# EAGLE design fancontroller (EAGLE 9.0.0)
Assembly variants: No OSC

## Sheet 1 of 2
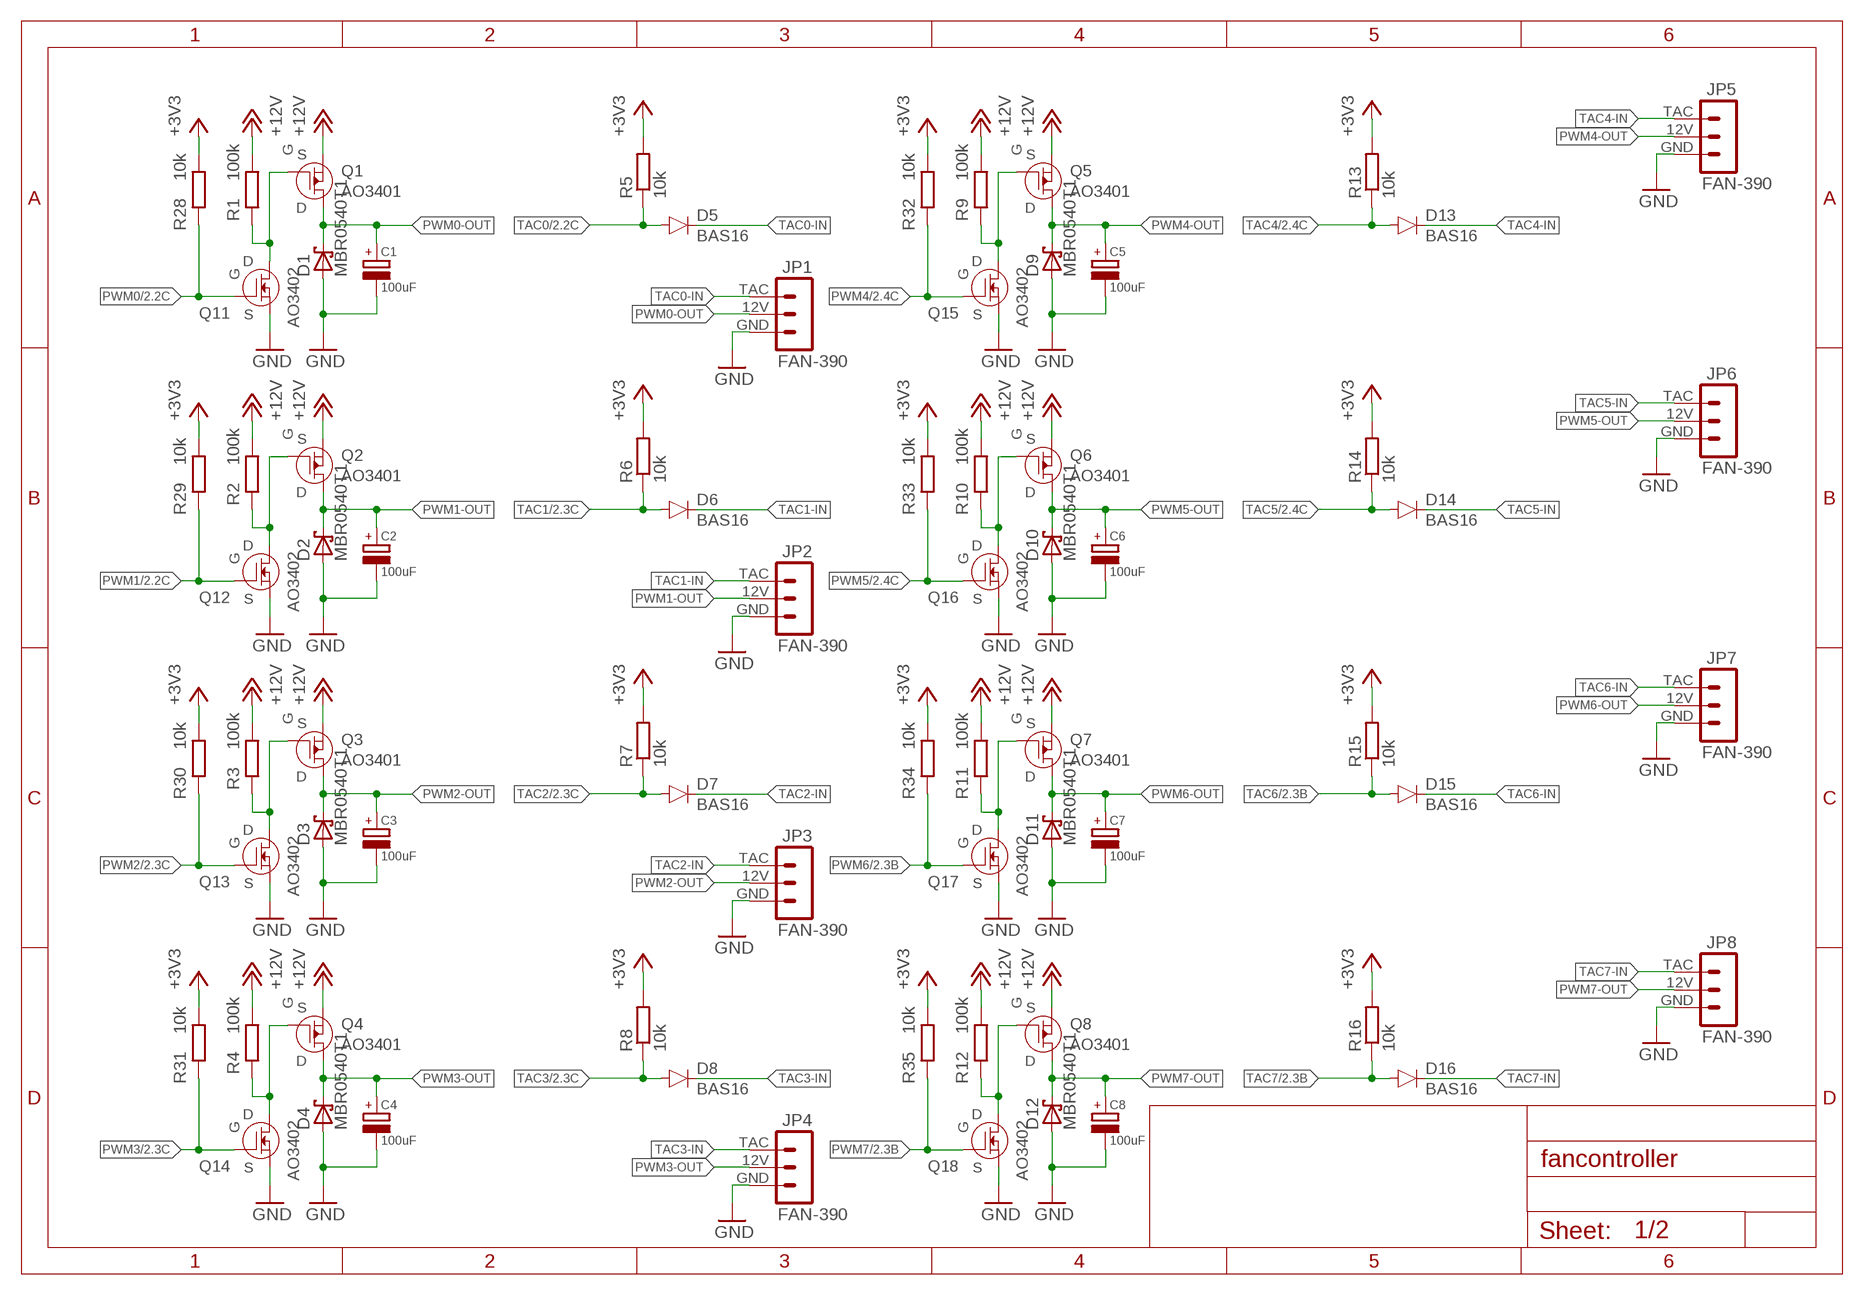
[diagram p0: schematic, sheet 1]

### Parts
C1  100uF  CAPACITOR  [CAP-D6.3]
C2  100uF  CAPACITOR  [CAP-D6.3]
C3  100uF  CAPACITOR  [CAP-D6.3]
C4  100uF  CAPACITOR  [CAP-D6.3]
C5  100uF  CAPACITOR  [CAP-D6.3]
C6  100uF  CAPACITOR  [CAP-D6.3]
C7  100uF  CAPACITOR  [CAP-D6.3]
C8  100uF  CAPACITOR  [CAP-D6.3]
D1  MBR0540T1  [SOD123]
D2  MBR0540T1  [SOD123]
D3  MBR0540T1  [SOD123]
D4  MBR0540T1  [SOD123]
D5  BAS16  [SOT23-3]
D6  BAS16  [SOT23-3]
D7  BAS16  [SOT23-3]
D8  BAS16  [SOT23-3]
D9  MBR0540T1  [SOD123]
D10  MBR0540T1  [SOD123]
D11  MBR0540T1  [SOD123]
D12  MBR0540T1  [SOD123]
D13  BAS16  [SOT23-3]
D14  BAS16  [SOT23-3]
D15  BAS16  [SOT23-3]
D16  BAS16  [SOT23-3]
JP1  FAN-390  [FAN-3PIN/90]
JP2  FAN-390  [FAN-3PIN/90]
JP3  FAN-390  [FAN-3PIN/90]
JP4  FAN-390  [FAN-3PIN/90]
JP5  FAN-390  [FAN-3PIN/90]
JP6  FAN-390  [FAN-3PIN/90]
JP7  FAN-390  [FAN-3PIN/90]
JP8  FAN-390  [FAN-3PIN/90]
Q1  AO3401  [SOT23-3]
Q2  AO3401  [SOT23-3]
Q3  AO3401  [SOT23-3]
Q4  AO3401  [SOT23-3]
Q5  AO3401  [SOT23-3]
Q6  AO3401  [SOT23-3]
Q7  AO3401  [SOT23-3]
Q8  AO3401  [SOT23-3]
Q11  AO3402  [SOT23-3]
Q12  AO3402  [SOT23-3]
Q13  AO3402  [SOT23-3]
Q14  AO3402  [SOT23-3]
Q15  AO3402  [SOT23-3]
Q16  AO3402  [SOT23-3]
Q17  AO3402  [SOT23-3]
Q18  AO3402  [SOT23-3]
R1  100k  RR0603  [R0603]
R2  100k  RR0603  [R0603]
R3  100k  RR0603  [R0603]
R4  100k  RR0603  [R0603]
R5  10k  RR0603  [R0603]
R6  10k  RR0603  [R0603]
R7  10k  RR0603  [R0603]
R8  10k  RR0603  [R0603]
R9  100k  RR0603  [R0603]
R10  100k  RR0603  [R0603]
R11  100k  RR0603  [R0603]
R12  100k  RR0603  [R0603]
R13  10k  RR0603  [R0603]
R14  10k  RR0603  [R0603]
R15  10k  RR0603  [R0603]
R16  10k  RR0603  [R0603]
R28  10k  RR0603  [R0603]
R29  10k  RR0603  [R0603]
R30  10k  RR0603  [R0603]
R31  10k  RR0603  [R0603]
R32  10k  RR0603  [R0603]
R33  10k  RR0603  [R0603]
R34  10k  RR0603  [R0603]
R35  10k  RR0603  [R0603]

### Nets
+3V3: R5.2 R6.2 R7.2 R8.2 R13.2 R14.2 R15.2 R16.2 R28.2 R29.2 R30.2 R31.2 R32.2 R33.2 R34.2 R35.2 ; also sheet 2
+12V: Q1.2(S) Q2.2(S) Q3.2(S) Q4.2(S) Q5.2(S) Q6.2(S) Q7.2(S) Q8.2(S) R1.2 R2.2 R3.2 R4.2 R9.2 R10.2 R11.2 R12.2 ; also sheet 2
GND: C1.N(NEG) C2.N(NEG) C3.N(NEG) C4.N(NEG) C5.N(NEG) C6.N(NEG) C7.N(NEG) C8.N(NEG) D1.A D2.A D3.A D4.A D9.A D10.A D11.A D12.A JP1.GND JP2.GND JP3.GND JP4.GND JP5.GND JP6.GND JP7.GND JP8.GND Q11.2(S) Q12.2(S) Q13.2(S) Q14.2(S) Q15.2(S) Q16.2(S) Q17.2(S) Q18.2(S) ; also sheet 2
PWM0: Q11.1(G) R28.1 ; also sheet 2
PWM0-1: Q1.1(G) Q11.3(D) R1.1
PWM0-OUT: C1.P(POS) D1.C JP1.12V Q1.3(D)
PWM1: Q12.1(G) R29.1 ; also sheet 2
PWM1-1: Q2.1(G) Q12.3(D) R2.1
PWM1-OUT: C2.P(POS) D2.C JP2.12V Q2.3(D)
PWM2: Q13.1(G) R30.1 ; also sheet 2
PWM2-1: Q3.1(G) Q13.3(D) R3.1
PWM2-OUT: C3.P(POS) D3.C JP3.12V Q3.3(D)
PWM3: Q14.1(G) R31.1 ; also sheet 2
PWM3-1: Q4.1(G) Q14.3(D) R4.1
PWM3-OUT: C4.P(POS) D4.C JP4.12V Q4.3(D)
PWM4: Q15.1(G) R32.1 ; also sheet 2
PWM4-1: Q5.1(G) Q15.3(D) R9.1
PWM4-OUT: C5.P(POS) D9.C JP5.12V Q5.3(D)
PWM5: Q16.1(G) R33.1 ; also sheet 2
PWM5-1: Q6.1(G) Q16.3(D) R10.1
PWM5-OUT: C6.P(POS) D10.C JP6.12V Q6.3(D)
PWM6: Q17.1(G) R34.1 ; also sheet 2
PWM6-1: Q7.1(G) Q17.3(D) R11.1
PWM6-OUT: C7.P(POS) D11.C JP7.12V Q7.3(D)
PWM7: Q18.1(G) R35.1 ; also sheet 2
PWM7-1: Q8.1(G) Q18.3(D) R12.1
PWM7-OUT: C8.P(POS) D12.C JP8.12V Q8.3(D)
TAC0: D5.1(A) R5.1 ; also sheet 2
TAC0-IN: D5.3(C) JP1.TAC
TAC1: D6.1(A) R6.1 ; also sheet 2
TAC1-IN: D6.3(C) JP2.TAC
TAC2: D7.1(A) R7.1 ; also sheet 2
TAC2-IN: D7.3(C) JP3.TAC
TAC3: D8.1(A) R8.1 ; also sheet 2
TAC3-IN: D8.3(C) JP4.TAC
TAC4: D13.1(A) R13.1 ; also sheet 2
TAC4-IN: D13.3(C) JP5.TAC
TAC5: D14.1(A) R14.1 ; also sheet 2
TAC5-IN: D14.3(C) JP6.TAC
TAC6: D15.1(A) R15.1 ; also sheet 2
TAC6-IN: D15.3(C) JP7.TAC
TAC7: D16.1(A) R16.1 ; also sheet 2
TAC7-IN: D16.3(C) JP8.TAC

## Sheet 2 of 2
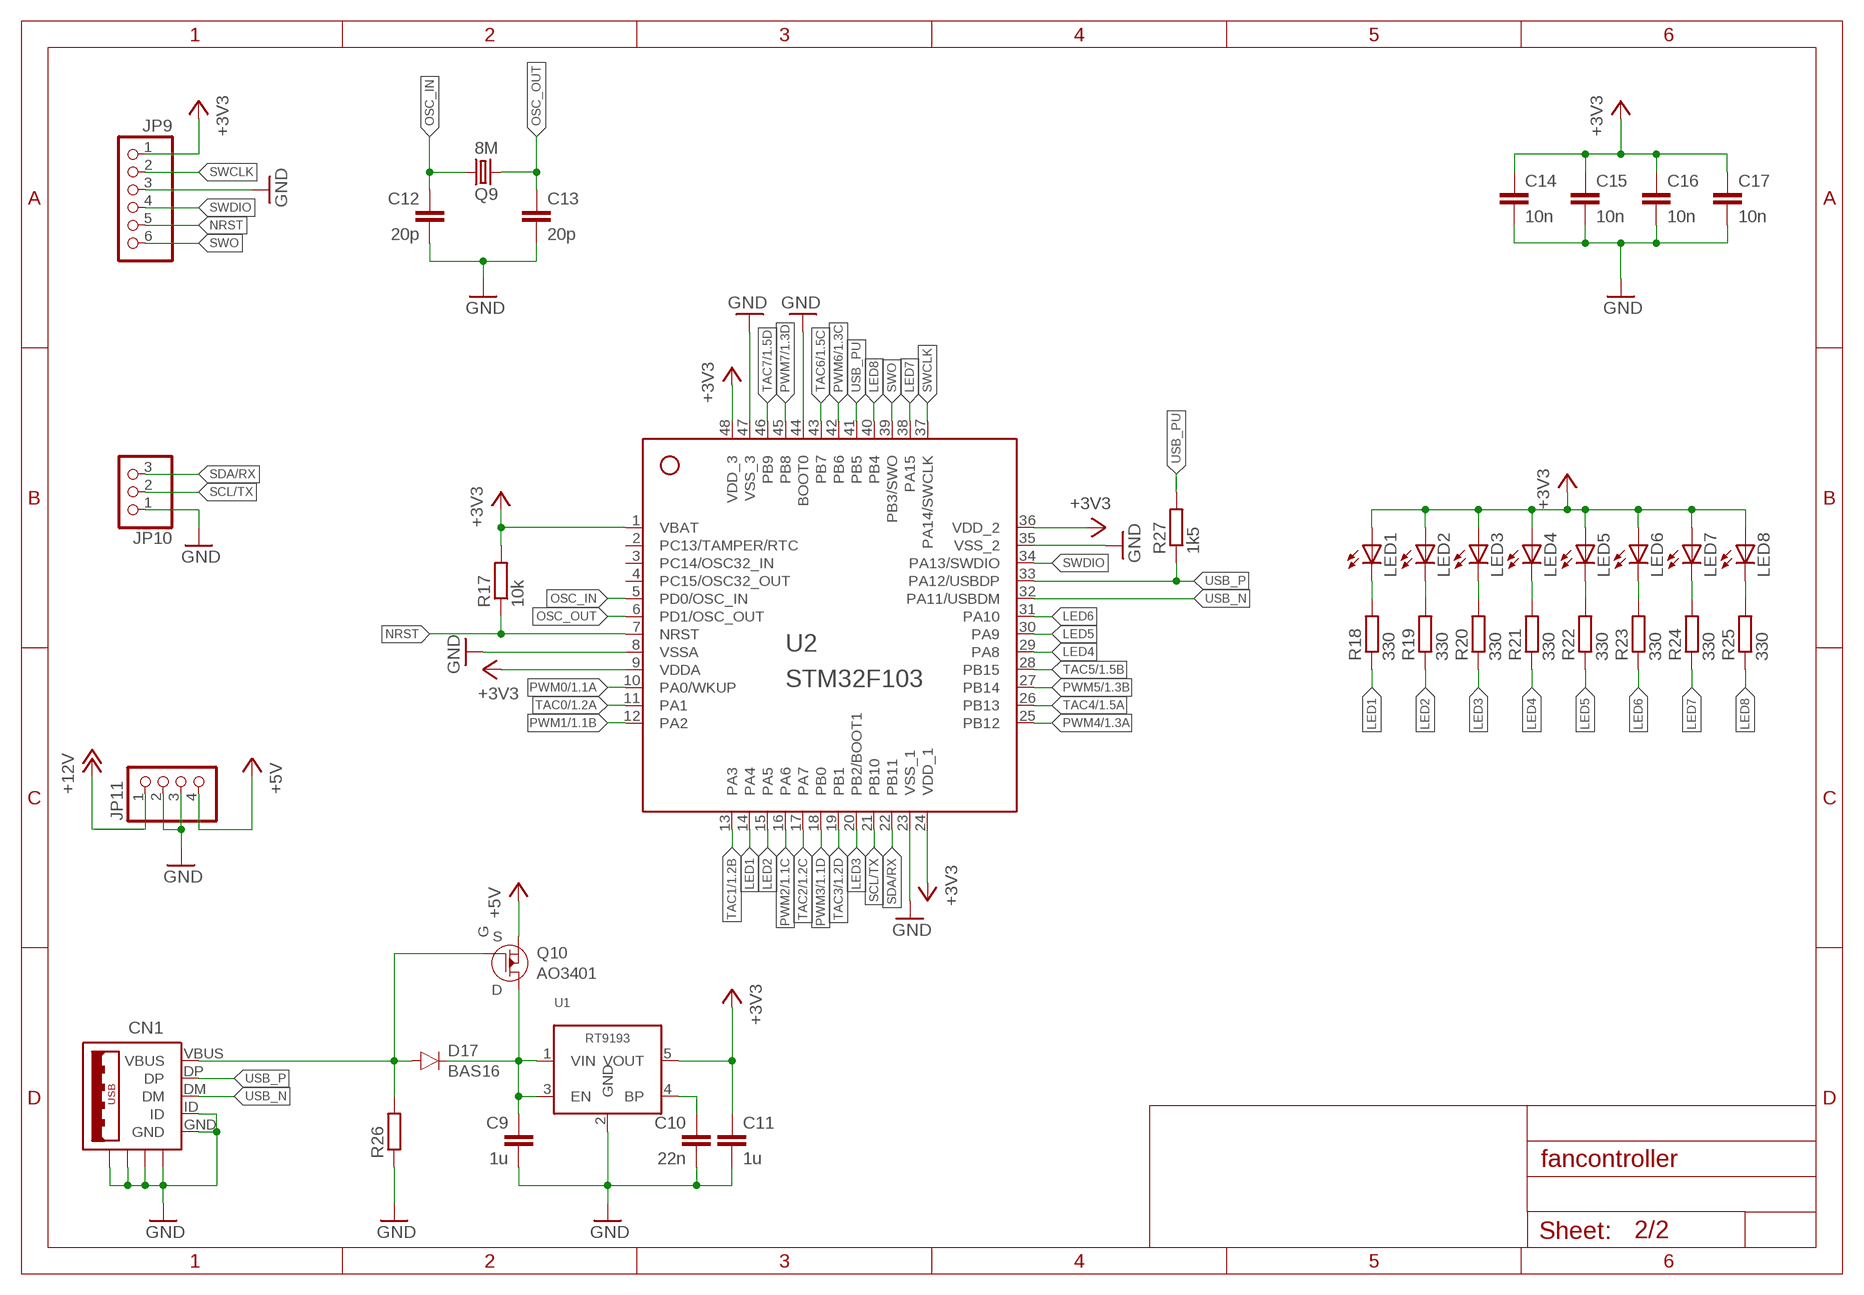
[diagram p1: schematic, sheet 2]

### Parts
C9  1u  C0603  [0603]
C10  22n  C0603  [0603]
C11  1u  C0603  [0603]
C12  20p  C0603  [0603]
C13  20p  C0603  [0603]
C14  10n  C0603  [0603]
C15  10n  C0603  [0603]
C16  10n  C0603  [0603]
C17  10n  C0603  [0603]
CN1  USB-MICROB-2TABS  [USB-MICROB-2]
D17  BAS16  [SOT23-3]
JP9  PINHD-1X6  [1X06]
JP10  PINHD-1X3/90  [1X03/90]
JP11  PINHD-1X4/90  [1X04/90]
LED1  LEDSML0805  [SML0805]
LED2  LEDSML0805  [SML0805]
LED3  LEDSML0805  [SML0805]
LED4  LEDSML0805  [SML0805]
LED5  LEDSML0805  [SML0805]
LED6  LEDSML0805  [SML0805]
LED7  LEDSML0805  [SML0805]
LED8  LEDSML0805  [SML0805]
Q9  8M  CRYSTALHC49S  [HC49/S]  (not fitted in variant No OSC)
Q10  AO3401  [SOT23-3]
R17  10k  RR0603  [R0603]
R18  330  RR0603  [R0603]
R19  330  RR0603  [R0603]
R20  330  RR0603  [R0603]
R21  330  RR0603  [R0603]
R22  330  RR0603  [R0603]
R23  330  RR0603  [R0603]
R24  330  RR0603  [R0603]
R25  330  RR0603  [R0603]
R26  RR0603  [R0603]
R27  1k5  RR0603  [R0603]
U1  RT9193  [SOT23-5]
U2  STM32F103-48LQFP  [LQFP-48]

### Nets
+3V3: C11.1 C14.1 C15.1 C16.1 C17.1 JP9.1 LED1.A LED2.A LED3.A LED4.A LED5.A LED6.A LED7.A LED8.A R17.2 U1.5(VOUT) U2.1(VBAT) U2.9(VDDA) U2.24(VDD_1) U2.36(VDD_2) U2.48(VDD_3) ; also sheet 1
+5V: JP11.4 Q10.2(S)
+12V: JP11.1 ; also sheet 1
GND: C9.2 C10.2 C11.2 C12.2 C13.2 C14.2 C15.2 C16.2 C17.2 CN1.GND CN1.GND@1(GND) CN1.GND@2(GND) CN1.GND@3(GND) CN1.GND@4(GND) CN1.ID JP9.3 JP10.1 JP11.2 JP11.3 R26.1 U1.2(GND) U2.8(VSSA) U2.23(VSS_1) U2.35(VSS_2) U2.44(BOOT0) U2.47(VSS_3) ; also sheet 1
LED1: R18.1 U2.14(PA4)
LED2: R19.1 U2.15(PA5)
LED3: R20.1 U2.20(PB2/BOOT1)
LED4: R21.1 U2.29(PA8)
LED5: R22.1 U2.30(PA9)
LED6: R23.1 U2.31(PA10)
LED7: R24.1 U2.38(PA15)
LED8: R25.1 U2.40(PB4)
N$2: LED3.C R20.2
N$4: LED2.C R19.2
N$5: LED1.C R18.2
N$6: LED4.C R21.2
N$7: LED7.C R24.2
N$10: LED8.C R25.2
N$11: LED5.C R22.2
N$12: LED6.C R23.2
N$36: C10.1 U1.4(BP)
NRST: JP9.5 R17.1 U2.7(NRST)
OSC_IN: C12.1 Q9.1 U2.5(PD0/OSC_IN)
OSC_OUT: C13.1 Q9.2 U2.6(PD1/OSC_OUT)
PWM0: U2.10(PA0/WKUP) ; also sheet 1
PWM1: U2.12(PA2) ; also sheet 1
PWM2: U2.16(PA6) ; also sheet 1
PWM3: U2.18(PB0) ; also sheet 1
PWM4: U2.25(PB12) ; also sheet 1
PWM5: U2.27(PB14) ; also sheet 1
PWM6: U2.42(PB6) ; also sheet 1
PWM7: U2.45(PB8) ; also sheet 1
SCL/TX: JP10.2 U2.21(PB10)
SDA/RX: JP10.3 U2.22(PB11)
SWCLK: JP9.2 U2.37(PA14/SWCLK)
SWDIO: JP9.4 U2.34(PA13/SWDIO)
SWO: JP9.6 U2.39(PB3/SWO)
TAC0: U2.11(PA1) ; also sheet 1
TAC1: U2.13(PA3) ; also sheet 1
TAC2: U2.17(PA7) ; also sheet 1
TAC3: U2.19(PB1) ; also sheet 1
TAC4: U2.26(PB13) ; also sheet 1
TAC5: U2.28(PB15) ; also sheet 1
TAC6: U2.43(PB7) ; also sheet 1
TAC7: U2.46(PB9) ; also sheet 1
USB_N: CN1.DM U2.32(PA11/USBDM)
USB_P: CN1.DP R27.1 U2.33(PA12/USBDP)
USB_PU: R27.2 U2.41(PB5)
VBUS: CN1.VBUS D17.1(A) Q10.1(G) R26.2
VIN: C9.1 D17.3(C) Q10.3(D) U1.1(VIN) U1.3(EN)
Unconnected: U2.2(PC13/TAMPER/RTC) U2.3(PC14/OSC32_IN) U2.4(PC15/OSC32_OUT)

## Library data of the parts
C1-C8 = tuetuopay:CAPACITOR
C9-C17 = tuetuopay:C
CN1 = tuetuopay:USB-MICROB
D1-D4 D9-D12 = tuetuopay:MBR0540T1
D5-D8 D13-D17 = tuetuopay:BAS16
JP1-JP8 = tuetuopay:FAN-3
JP9 = pinhead:PINHD-1X6: PIN HEADER
JP10 = pinhead:PINHD-1X3: PIN HEADER
JP11 = pinhead:PINHD-1X4: PIN HEADER
LED1-LED8 = led:LED: LED OSRAM: - CHIPLED LG R971, LG N971, LY N971, LG Q971, LY Q971, LO R971, LY R971 LH N974, LH R974 LS Q976, LO Q976, LY Q976 LO Q996 - Hyper CHIPLED LW Q18S LB Q993, LB Q99A, LB R99A - SideLED LS A670, LO A670, LY A670, LG A670, LP A670 LB A673, LV A673, LT A673, LW A673 LH A674 LY A675 LS A676, LA A676, LO A676, LY A676, LW A676 LS A679, LY A679, LG A679 - Hyper Micro SIDELED® LS Y876, LA Y876, LO Y876, LY Y876 LT Y87S - SmartLED LW L88C, LW L88S LB L89C, LB L89S, LG L890 LS L89K, LO L89K, LY L89K LS L896, LA L896, LO L896, LY L896 - TOPLED LS T670, LO T670, LY T670, LG T670, LP T670 LSG T670, LSP T670, LSY T670, LOP T670, LYG T670 LG T671, LOG T671, LSG T671 LB T673, LV T673, LT T673, LW T673 LH T674 LS T676, LA T676, LO T676, LY T676, LB T676, LH T676, LSB T676, LW T676 LB T67C, LV T67C, LT T67C, LS T67K, LO T67K, LY T67K, LW E67C LS E67B, LA E67B, LO E67B, LY E67B, LB E67C, LV E67C, LT E67C LW T67C LS T679, LY T679, LG T679 LS T770, LO T770, LY T770, LG T770, LP T770 LB T773, LV T773, LT T773, LW T773 LH T774 LS E675, LA E675, LY E675, LS T675 LS T776, LA T776, LO T776, LY T776, LB T776 LHGB T686 LT T68C, LB T68C - Hyper Mini TOPLED® LB M676 - Mini TOPLED Santana® LG M470 LS M47K, LO M47K, LY M47K Source: http://www.osram.convergy.de LUXEON: - LUMILED® LXK2-PW12-R00, LXK2-PW12-S00, LXK2-PW14-U00, LXK2-PW14-V00 LXK2-PM12-R00, LXK2-PM12-S00, LXK2-PM14-U00 LXK2-PE12-Q00, LXK2-PE12-R00, LXK2-PE12-S00, LXK2-PE14-T00, LXK2-PE14-U00 LXK2-PB12-K00, LXK2-PB12-L00, LXK2-PB12-M00, LXK2-PB14-N00, LXK2-PB14-P00, LXK2-PB14-Q00 LXK2-PR12-L00, LXK2-PR12-M00, LXK2-PR14-Q00, LXK2-PR14-R00 LXK2-PD12-Q00, LXK2-PD12-R00, LXK2-PD12-S00 LXK2-PH12-R00, LXK2-PH12-S00 LXK2-PL12-P00, LXK2-PL12-Q00, LXK2-PL12-R00 Source: www.luxeon.com KINGBRIGHT: KA-3528ASYC Source: www.kingbright.com
Q1-Q8 Q10 = tuetuopay:AO3401
Q9 = crystal:CRYSTAL: CRYSTAL; OC_FARNELL: 1667008; OC_NEWARK: unknown
Q11-Q18 = tuetuopay:AO3402
R1-R35 = tuetuopay:R: RESISTOR, European symbol
U1 = tuetuopay:RT9193
U2 = tuetuopay:STM32F103-48

## Board
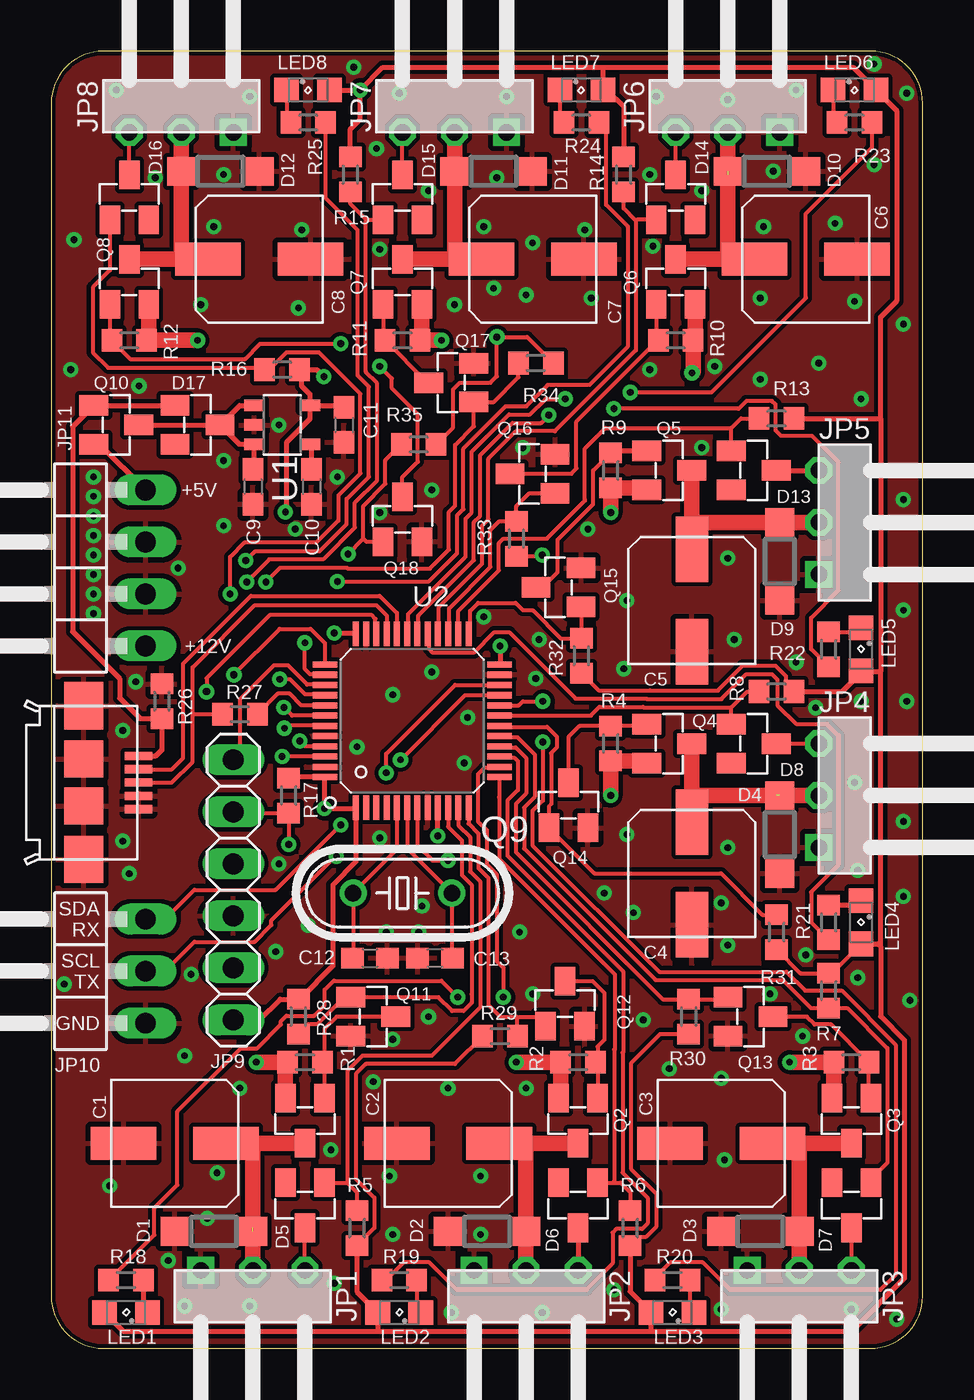
[diagram p2: board, top side]
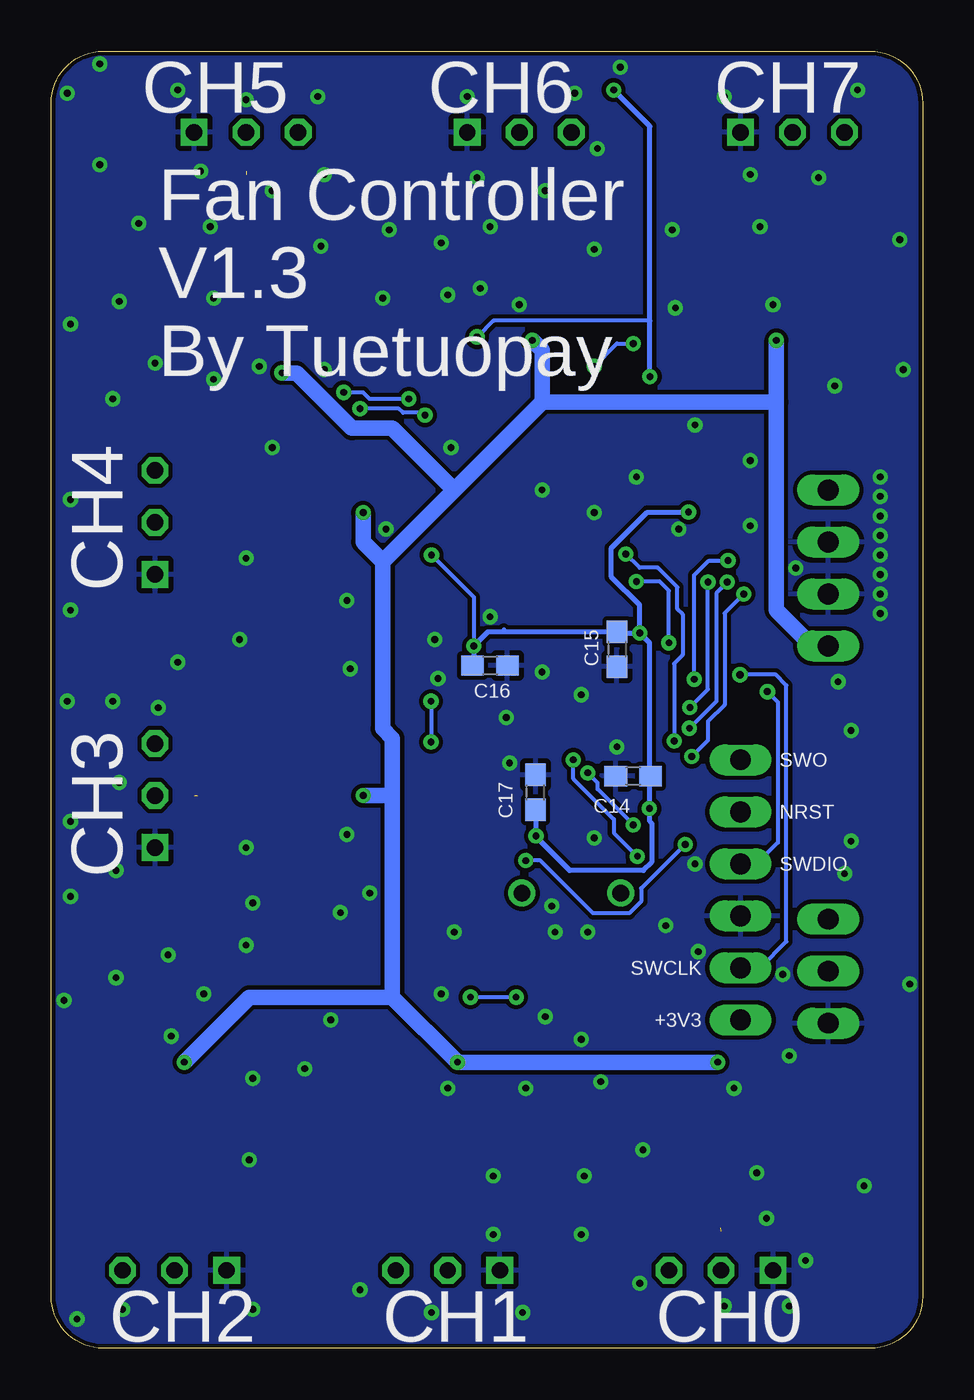
[diagram p3: board, bottom side, seen from below]

Size 42.53 x 63.33 mm. Coordinates in mm from the lower left corner, seen from the top.
Outline: 0,60.79 0,2.54 arc90 2.54,0 39.99,0 arc90 42.53,2.54 42.53,60.8 arc90 40.01,63.33 2.54,63.33 arc90 0,60.79
Copper layers (1*16): Top 0.035mm / dielectric 1.5mm / Bottom 0.035mm
Design rules "mine *": minimum track width 8mil, minimum drill 13mil, track to track 8mil, track to pad 8mil, pad to pad 8mil, via to via 8mil, smd to smd 8mil, copper to edge 8mil, drill to drill 8mil, minimum pad ring 10mil, minimum via ring 8mil, stop-mask expansion 3mil, vias tented up to drill 25mil, thermal gap 10mil

### Footprints (pad centres in the part's own frame; a part is rotated, then mirrored left to right if it is on the bottom)
CAP-D6.3 = smd 3.2 x 1.6: N 2.5,0; P -2.5,0
0603 = smd 1.1 x 1: 1 -0.85,0; 2 0.85,0
USB-MICROB-2 = smd 0.4 x 1.35: DM -0.65,2.675; DP 0,2.675; GND 1.3,2.675; ID 0.65,2.675; VBUS -1.3,2.675 | smd 2.3 x 1.9: GND@1 -3.75,0; GND@4 3.75,0 | smd 1.8 x 1.9: GND@2 -1.15,0; GND@3 1.15,0
SOD123 = smd 1.4 x 1.4: A 1.9,0; C -1.9,0
SOT23-3 = smd 1 x 1.4: 1 -0.95,-1.1; 2 0.95,-1.1; 3 0,1.1
FAN-3PIN/90 = drill 0.8 octagon: 12V 0,0; TAC 2.54,0 | drill 0.8 square: GND -2.54,0
1X06 = drill 1.016 long: 1 -6.35,0; 2 -3.81,0; 3 -1.27,0; 4 1.27,0; 5 3.81,0; 6 6.35,0
1X03/90 = drill 1.016 long: 1 -2.54,-3.81; 2 0,-3.81; 3 2.54,-3.81
1X04/90 = drill 1.016 long: 1 -3.81,-3.81; 2 -1.27,-3.81; 3 1.27,-3.81; 4 3.81,-3.81
SML0805 = smd 1.2 x 1.2: A 1.05,0; C -1.05,0
HC49/S = drill 0.813: 1 -2.413,0; 2 2.413,0
R0603 = smd 1 x 1.1: 1 -0.85,0; 2 0.85,0
SOT23-5 = smd 0.55 x 1: 1 -0.95,-1.35; 2 0,-1.35; 3 0.95,-1.35; 4 0.95,1.35; 5 -0.95,1.35
LQFP-48 = smd 0.3 x 1.2: 1 -2.75,-4.25; 2 -2.25,-4.25; 3 -1.75,-4.25; 4 -1.25,-4.25; 5 -0.75,-4.25; 6 -0.25,-4.25; 7 0.25,-4.25; 8 0.75,-4.25; 9 1.25,-4.25; 10 1.75,-4.25; 11 2.25,-4.25; 12 2.75,-4.25; 25 2.75,4.25; 26 2.25,4.25; 27 1.75,4.25; 28 1.25,4.25; 29 0.75,4.25; 30 0.25,4.25; 31 -0.25,4.25; 32 -0.75,4.25; 33 -1.25,4.25; 34 -1.75,4.25; 35 -2.25,4.25; 36 -2.75,4.25 | smd 1.2 x 0.3: 13 4.25,-2.75; 14 4.25,-2.25; 15 4.25,-1.75; 16 4.25,-1.25; 17 4.25,-0.75; 18 4.25,-0.25; 19 4.25,0.25; 20 4.25,0.75; 21 4.25,1.25; 22 4.25,1.75; 23 4.25,2.25; 24 4.25,2.75; 37 -4.25,2.75; 38 -4.25,2.25; 39 -4.25,1.75; 40 -4.25,1.25; 41 -4.25,0.75; 42 -4.25,0.25; 43 -4.25,-0.25; 44 -4.25,-0.75; 45 -4.25,-1.25; 46 -4.25,-1.75; 47 -4.25,-2.25; 48 -4.25,-2.75

### Placement (x,y rotation side)
C1  6.03,10 180 top
C2  19.37,10 180 top
C3  32.7,10 180 top
C4  31.27,23.18 270 top
C5  31.27,36.51 270 top
C6  36.83,53.18 0 top
C7  23.5,53.18 0 top
C8  10.16,53.18 0 top
C9  9.84,42.07 270 top
C10  12.7,42.07 270 top
C11  14.29,45.09 270 top
C12  15.56,19.05 0 top
C13  18.73,19.05 180 top
C14  14.13,27.94 180 bottom
C15  14.92,34.13 270 bottom
C16  21.11,33.34 0 bottom
C17  18.89,27.15 90 bottom
CN1  1.59,27.62 270 top
D1  7.94,5.71 180 top
D2  21.27,5.71 180 top
D3  34.61,5.71 180 top
D4  35.56,25.08 270 top
D5  12.38,6.98 180 top
D6  25.72,6.98 180 top
D7  39.05,6.98 180 top
D8  34.29,29.53 270 top
D9  35.56,38.42 270 top
D10  34.92,57.47 0 top
D11  21.59,57.47 0 top
D12  8.26,57.47 0 top
D13  34.29,42.86 270 top
D14  30.48,56.2 0 top
D15  17.14,56.2 0 top
D16  3.81,56.2 0 top
D17  7.14,45.09 270 top
JP1  9.84,3.81 0 top
JP2  23.18,3.81 0 top
JP3  36.51,3.81 0 top
JP4  37.47,26.99 90 top
JP5  37.47,40.32 90 top
JP6  33.02,59.37 180 top
JP7  19.68,59.37 180 top
JP8  6.35,59.37 180 top
JP9  8.89,22.38 90 top
JP10  0.79,18.42 90 top
JP11  0.79,38.1 90 top
LED1  3.65,1.75 180 top
LED2  16.99,1.75 180 top
LED3  30.32,1.75 180 top
LED4  39.53,20.8 270 top
LED5  39.53,34.13 270 top
LED6  39.21,61.44 0 top
LED7  25.88,61.44 0 top
LED8  12.54,61.44 0 top
Q1  12.38,11.11 180 top
Q2  25.72,11.11 180 top
Q3  39.05,11.11 180 top
Q4  30.16,29.53 270 top
Q5  30.16,42.86 270 top
Q6  30.48,52.07 0 top
Q7  17.14,52.07 0 top
Q8  3.81,52.07 0 top
Q9  17.14,22.23 0 top
Q10  3.17,45.09 270 top
Q11  15.72,16.19 270 top
Q12  25.08,16.83 0 top
Q13  34.13,16.19 270 top
Q14  25.24,26.51 0 top
Q15  24.77,37.15 90 top
Q16  23.5,42.7 90 top
Q17  19.53,47.15 90 top
Q18  17.14,40.48 0 top
R1  12.38,13.97 180 top
R2  25.72,13.97 180 top
R3  39.05,13.97 180 top
R4  27.3,29.53 270 top
R5  14.92,5.87 270 top
R6  28.26,5.87 270 top
R7  37.94,17.46 90 top
R8  35.4,32.07 0 top
R9  27.3,42.86 270 top
R10  30.48,49.21 0 top
R11  17.14,49.21 0 top
R12  3.81,49.21 0 top
R13  35.4,45.4 0 top
R14  27.94,57.31 90 top
R15  14.61,57.31 90 top
R16  11.27,47.78 0 top
R17  11.59,26.99 90 top
R18  3.65,3.33 0 top
R19  16.99,3.33 0 top
R20  30.32,3.33 0 top
R21  37.94,20.8 90 top
R22  37.94,34.13 90 top
R23  39.21,59.85 180 top
R24  25.88,59.85 180 top
R25  12.54,59.85 180 top
R26  5.4,31.59 270 top
R27  9.21,30.96 0 top
R28  12.06,16.19 90 top
R29  21.91,15.24 180 top
R30  31.11,16.19 270 top
R31  35.4,20.32 270 top
R32  25.88,33.81 270 top
R33  22.7,39.53 270 top
R34  23.65,48.1 0 top
R35  17.94,44.13 0 top
U1  11.27,45.09 270 top
U2  17.62,30.64 0 top

### Tracks (layer width: path | path; a pad name or v marks a point on that pad's centre or on a via)
+3V3  (via drill 0.33, 0.35)
  Top 0.203: 38.09,18.31 LED4.A | 28.26,4.92 28.76,5.42 29.01,5.42 29.52,5.93 29.52,7.54 28.3,8.77 28.3,13.91 29.73,15.34 R30.2 | R29.2 19.7,13.88 15.36,13.88 14.86,13.39 14.86,8.26 15.78,7.35 15.78,5.88 R5.2 | R32.2 26.71,32.12 29.22,32.12 29.24,32.11 32.54,32.11 33.76,33.33 35.35,33.33 35.85,32.82 35.85,32.47 R8.2 | v23.97,38.73 23.91,38.68 R33.2 | 26.51,61.11 26.51,61.12 26.83,61.44 LED7.A | R35.2 19.62,44.97 19.62,46.83 19.95,47.15 21.43,47.15 21.75,47.47 v21.75,49.37 23.23,49.37 R34.2 | R31.2 36.56,18.31 R7.2
  Top 0.254: v18.87,25.01 U2.9 | v13.81,34.93 14.84,34.93 U2.36 | v21.91,34.29 21.91,33.43 U2.24 | R17.2 11.64,27.89 U2.48 13.34,27.85 v13.34,26.35 14.84,26.35 U2.1 14.87,23.77 13.74,22.64 13.74,18.66 12.12,17.04 R28.2 11.17,17.04 10.16,16.03 JP9.1 9.68,16.03 | U1.5 12.62,46.59 12.22,46.99 12.22,47.68 R16.2 12.97,47.78 v13.31,47.44 | U1.5 14.19,46.04 C11.1 | U1.5 12.62,45.38 11.47,44.23 11.47,40.87 v11.43,40.82 | 26.85,62.55 39.15,62.55 LED6.A 41.26,60.44 41.26,51.13 40.48,50.35 40.48,45.39 | 13.65,61.44 LED8.A v15.08,61.44 | R14.2 27.94,60.64 27.15,61.44 LED7.A 26.93,62.47 26.85,62.55 | 40.48,45.39 40.48,33.04 | R13.2 36.27,45.39 40.48,45.39 | 39.57,33.04 LED5.A | 39.57,33.04 40.48,33.04 | R8.2 38.6,32.07 39.57,33.04 | 40.48,19.62 40.48,33.04 | 40.48,19.62 40.48,16.2 41.65,15.04 41.65,3.41 39.05,0.82 29.28,0.82 | LED1.A 3.53,0.82 15.86,0.82 | 29.28,0.82 15.86,0.82 | 15.86,0.82 15.94,0.89 LED2.A 14.92,2.76 R5.2 | 29.28,0.82 29.27,0.83 LED3.A 28.26,2.76 28.26,4.92 R6.2 | LED4.A 40.36,19.75 40.48,19.62 | R7.2 38.09,18.31 | R15.2 14.61,59.53 15.08,60.01 v15.08,61.44 | v15.08,61.44 16.19,62.55 26.85,62.55
  Bottom 0.203: 20.44,35.1 20.32,34.98 | v23.97,38.73 21.91,36.67 v21.91,34.29 | 13.31,50.16 20.95,50.16 v21.75,49.37
  Bottom 0.254: C17.1 18.89,25.35 v18.87,25.01 18.92,25.01 17.23,23.32 13.63,23.32 13.22,23.73 13.22,25.64 13.34,25.75 v13.34,26.35 13.34,27.88 | 13.34,27.88 C14.1 | v13.81,34.93 14.87,34.93 C15.1 20.32,34.98 21.22,34.98 v21.91,34.29 21.91,33.39 C16.1 | 13.95,34.94 v13.81,34.93 | v13.81,34.93 13.34,34.45 13.34,27.88 | v13.31,47.44 13.31,50.16 13.31,59.67 v15.08,61.44 | v13.81,34.93 13.81,36.29 15.19,37.67 15.19,39.08 13.44,40.82 v11.43,40.82
+5V
  Top 0.254: JP11.4 2.38,44.13 Q10.2
+12V  (via drill 0.33)
  Top 0.762: 11.43,13.87 Q1.2 | 11.43,13.87 R1.2 | Q2.2 24.87,12.31 R2.2 v22.7,13.97 | Q3.2 38.2,12.31 R3.2 v36.04,13.97 | R4.2 28.96,28.68 Q4.2 | Q5.2 28.96,42.01 R9.2 v27.3,40.8 | Q6.2 31.43,49.31 R10.2 31.33,47.68 v31.27,47.62 | Q7.2 18.09,49.31 R11.2 v19.05,49.21 | 4.76,49.31 Q8.2 | 4.76,49.31 R12.2 | v7.14,49.21 4.86,49.21 4.76,49.31 | 27.3,28.58 R4.2 | v10,13.97 11.33,13.97 11.43,13.87 | R4.2 v27.3,26.99
  Bottom 0.762: JP11.1 5.4,34.29 7.14,36.04 7.14,46.2 | 7.14,46.2 v7.14,49.21 | 7.14,46.2 18.57,46.2 | 18.57,46.2 22.86,41.91 | 22.86,41.91 26.35,38.42 | 26.35,38.42 26.35,30.26 25.88,29.79 25.88,26.99 | 25.88,26.99 25.88,17.15 | 25.88,17.15 v22.7,13.97 v10,13.97 | 25.88,17.15 32.86,17.15 v36.04,13.97 | v31.27,47.62 30.56,47.62 27.86,44.93 25.88,44.93 22.86,41.91 | v27.3,26.99 25.88,26.99 | v27.3,40.8 27.3,39.37 26.35,38.42 | v19.05,49.21 18.57,48.74 18.57,46.2
GND  (via drill 0.33)
  other vias: 3.49,30.16 4.13,32.54 3.49,24.77 3.81,23.18 14.92,29.37 16.03,24.92 18.1,21.59 15.72,13.02 22.86,20.32 23.5,17.3 23.18,12.7 19.37,12.7 20.95,8.41 16.51,8.41 8.1,8.57 7.62,6.35 6.51,2.06 9.68,2.06 13.81,3.18 16.67,5.56 20.95,5.56 2.86,7.94 6.51,14.29 0.64,17.78 41.27,1.43 41.59,22.07 41.91,16.99 33.02,19.69 39.37,18.1 26.99,22.23 28.1,25.08 33.02,24.45 23.65,32.7 18.57,33.02 16.67,31.91 21.11,35.72 33.34,34.61 27.94,33.18 28.1,36.51 33.02,38.58 36.35,33.5 26.19,40.01 31.75,43.97 34.61,47.31 39.53,46.36 37.47,48.1 39.21,51.12 38.26,54.93 34.77,54.77 40.16,57.79 35.24,57.47 36.35,61.44 29.53,61.12 33.02,60.96 29.21,57.31 31.75,56.52 26.04,54.61 23.5,53.98 23.18,51.44 26.35,51.28 19.68,50.96 21.59,51.75 13.97,42.55 11.11,45.09 8.41,40.16 8.41,43.34 4.29,46.99 12.06,50.8 7.3,50.96 7.94,54.77 12.22,54.61 8.41,57.31 9.68,61.12 3.17,61.44 14.76,62.55 16.99,61.28 22.23,61.12 2.06,42.55 2.06,35.88 0.95,47.78 30.16,13.65 32.7,13.18 32.86,9.21 39.05,1.91 32.7,1.91 27.46,2.86 19.53,1.75 23.97,1.75 13.65,9.68 9.21,12.7 12.54,20.64 10.95,19.37 6.83,18.26 11.11,23.65 20.32,30.8 20.16,28.58 2.06,36.83 2.06,37.78 2.06,38.73 2.06,39.69 2.06,40.64 2.06,41.59 5.08,57.15 16.03,53.66 18.41,56.52 15.88,58.58 21.75,57.15 21.11,54.77 29.37,53.82 29.21,47.78 34.61,51.28 32.38,47.94 40.16,62.71 41.75,61.28 41.59,50.01 41.59,41.43 41.59,36.04 41.75,31.59 41.59,25.72 39.53,31.59 39.21,27.62 39.37,23.34 37.31,31.27 1.11,54.13 6.19,38.1 16.35,20.32 17.94,20.32 28.42,21.27 32.7,21.75 23.02,43.97 36.67,15.24 23.81,34.61 11.91,40.01 18.57,41.91 16.03,40.8 35.08,17.3 28.89,16.03 18.41,16.19 16.67,15.08 5.71,4.29 36.83,19.21
  pour Top: 0,0 42.55,0 42.55,63.34 0,63.34
  pour Bottom: 0,0 42.55,0 42.55,63.34 0,63.34
LED1  (via drill 0.33)
  Top 0.203: U2.14 21.83,28.34 21.14,28.34 20.83,28.02 20.83,25.73 21.26,25.3 21.26,23.61 21.74,23.13 21.74,18.9 22.07,18.57 v22.07,17.15 | v19.84,17.15 19.72,17.27 19.04,17.95 13.79,17.95 13.34,17.5 13.34,16.75 12.83,16.24 11.48,16.24 11.21,15.97 11.21,15.81 10.06,14.66 9.24,14.66 6.15,11.56 6.15,7.98 5.03,6.86 5.03,5.54 2.83,3.33
  Top 0.254: R18.1 2.83,3.33 | 21.89,28.37 U2.14 21.85,28.37
  Bottom 0.203: v19.84,17.15 v22.07,17.15
LED2
  Top 0.203: U2.15 21.92,28.84 22.6,28.84 22.78,28.67 22.78,27.25 22.27,26.74 22.27,24.06 27.91,18.41 27.91,14.45 27.89,14.43 27.89,8.57 29.11,7.35 29.11,6.1 28.84,5.83 27.58,5.83 27.4,5.65 27.4,4.14 26.11,2.85 19.8,2.85 18.46,4.19 17.21,4.19 16.36,3.33 R19.1
LED3  (via drill 0.33)
  Top 0.203: U2.20 22.82,31.39 23.02,31.59 v24,31.59 | R20.1 29.47,3.44 30.22,4.19 31.8,4.19 33.13,2.85 40.48,2.85 41.21,3.59 41.21,14.82 38.57,17.46 36.8,17.46 35.88,18.38 29.67,18.38 23.49,24.56 23.49,26.24 24,26.75 v24,29.6
  Bottom 0.203: v24,31.59 v24,29.6
LED4
  Top 0.203: U2.29 18.42,34.84 18.42,34.16 18.59,33.98 20.65,33.98 21.63,34.96 22.35,34.96 25.6,31.72 29.05,31.72 29.07,31.7 32.7,31.7 33.92,32.92 35.18,32.92 35.45,32.65 35.45,31.39 36.35,30.49 37.86,30.49 38.42,29.92 38.42,23.61 37.09,22.27 37.09,20.8 R21.1
LED5  (via drill 0.33)
  Top 0.203: R22.1 37.09,34.14 37.09,35.66 38.42,37 38.42,43.26 37.14,44.55 35.62,44.55 35.36,44.82 35.36,46.08 35.18,46.26 33.92,46.26 33.55,45.88 v27.46,45.88 | U2.30 17.92,34.93 17.92,35.77 20.63,38.48 20.63,40.33 20.93,40.64 20.93,43.6 22.51,45.18 23.91,45.18 v24.29,45.56
  Top 0.254: 37.61,32.95 R22.1 37.94,33.46
  Bottom 0.203: v27.46,45.88 25.56,45.88 25.36,45.68 24.41,45.68 v24.29,45.56
LED6  (via drill 0.33)
  Top 0.203: v28.26,46.67 32.23,46.67 36.83,51.28 36.83,55.4 40.06,58.63 R23.1 | v25.08,46.36 24.13,46.36 23.36,45.59 22.34,45.59 20.52,43.77 20.52,40.81 20.22,40.5 20.22,38.65 17.42,35.85 17.42,34.93 U2.31
  Top 0.254: R23.1 39.88,59.85
  Bottom 0.203: v25.08,46.36 26.99,46.36 27.31,46.67 v28.26,46.67
LED7  (via drill 0.33)
  Top 0.203: 13.35,32.91 12.63,32.91 12.38,33.16 v12.38,34.45 | R24.1 27.09,59.49 27.09,55.83 28.13,54.79 28.13,48.9 26.26,47.03 24.23,47.03 23.2,46 22.17,46 20.12,43.94 20.12,40.97 19.81,40.67 19.81,38.82 18.43,37.44 v13.97,37.44
  Top 0.254: 13.35,32.87 U2.38 13.35,32.91
  Bottom 0.203: v12.38,34.45 12.38,36.99 12.83,37.44 v13.97,37.44
LED8  (via drill 0.33)
  Top 0.203: v9.5,38.46 9.97,38.93 13.1,38.93 14.42,40.24 14.42,41.47 15.5,42.55 15.5,46.95 14.95,47.5 14.95,54.6 13.39,56.17 R25.1 | U2.40 13.33,31.93 12.39,31.93 11.66,32.66 v11.15,32.66
  Bottom 0.203: v9.5,38.46 10.44,38.46 11.15,37.74 11.15,37.14 v11.15,32.66
N$2
  Top 0.203: R20.2 31.17,1.95
  Top 0.254: 31.17,1.95 LED3.C
N$4
  Top 0.203: R19.2 17.84,1.95
  Top 0.254: 17.84,1.95 LED2.C
N$5
  Top 0.254: R18.2 4.5,1.95 LED1.C
N$6
  Top 0.254: R21.2 39.33,21.65 LED4.C
N$7
  Top 0.203: LED7.C 24.83,60.05
  Top 0.254: 24.83,60.05 R24.2
N$10
  Top 0.203: LED8.C 11.49,60.05
  Top 0.254: 11.49,60.05 R25.2
N$11
  Top 0.203: R22.2 39.33,34.98
  Top 0.254: 39.33,34.98 LED5.C
N$12
  Top 0.203: LED6.C 38.16,60.05 R23.2
N$36
  Top 0.254: U1.4 12.7,44.06 C10.1
NRST  (via drill 0.33)
  Top 0.203: 8.95,26.14 R17.1 v11.59,24.61 | U2.7 17.87,24.56 18.62,23.81 v19.37,23.81
  Top 0.254: 8.95,26.14 JP9.5
  Bottom 0.203: v11.59,24.61 13.74,22.45 13.74,21.81 14.32,21.23 16.08,21.23 18.66,23.81 v19.37,23.81
OSC_IN
  Top 0.203: U2.5 16.87,24.36 15.7,23.19 Q9.1 14.73,18.98
  Top 0.254: 14.73,18.98 C12.1
OSC_OUT
  Top 0.203: U2.6 17.37,24.41 Q9.2 19.56,18.98
  Top 0.254: 19.56,18.98 C13.1
PWM0
  Top 0.203: U2.10 19.37,25.46 20.04,24.8 20.04,23.11 20.52,22.62 20.52,17.29 20.52,17.28 20.52,16.87 20.12,16.47 19.57,16.47 18.89,17.14 Q11.1 14.31,17.14 13,15.83 12.55,15.83 R28.1
PWM0-1
  Top 0.203: Q1.1 13.33,13.87 13.33,15.59 13.94,16.19 Q11.3
  Top 0.254: R1.1 13.33,13.87 13.33,14.2 13.42,14.29
PWM0-OUT  (1 unrouted)
  Top 0.762: 9.84,5.89 JP1.12V | C1.P 9.84,10 | 9.84,10 Q1.3 | D1.C 9.84,10
PWM1
  Top 0.203: 22.7,16.19 21.91,16.19 21.34,16.76 21.34,22.96 20.85,23.44 20.85,25.13 20.37,25.61 U2.12 | R29.1 22.76,16.14 22.7,16.19 | 22.7,16.19 23.83,16.19 Q12.1
PWM1-1
  Top 0.203: Q2.1 26.67,13.87 26.67,14.73 27,15.06 27,17.35 26.42,17.93 Q12.3 | 26.5,14.04 R2.1
  Top 0.254: R2.1 26.67,13.87
PWM1-OUT
  Top 0.762: C2.P 23.18,10 | 23.18,10 25.71,10 Q2.3 | 23.18,10 23.17,10 D2.C JP2.12V
PWM2
  Top 0.203: U2.16 21.92,29.34 22.67,29.34 23.18,28.83 23.18,27.08 22.67,26.57 22.67,24.23 29.86,17.04 R30.1 32.93,17.04 Q13.1 32.86,17.14
PWM2-1
  Top 0.203: 39.9,12.31 R3.1 38.06,15.81 37.27,15.81 36.88,16.19 Q13.3
  Top 0.254: 39.9,12.31 Q3.1
PWM2-OUT
  Top 0.762: C3.P 36.35,10 | 36.35,10 Q3.3 | 36.35,10 36.51,9.85 D3.C JP3.12V
PWM3
  Top 0.203: U2.18 21.92,30.34 24.21,30.34 24.67,29.88 24.67,29.32 24.4,29.06 24.4,26.56 24.29,26.45 Q14.1 26.51,23.19 32.69,23.19 34.71,21.17 R31.1
PWM3-1
  Top 0.203: 28.96,30.38 R4.1 25.77,30.38 25.24,29.85 Q14.3 | 29.38,30.47 Q4.1
  Top 0.254: 28.96,30.38 Q4.1
PWM3-OUT  (1 unrouted)
  Top 0.762: 35.38,26.99 JP4.12V | Q4.3 31.26,26.99 | 31.26,26.99 C4.P | D4.C 31.27,26.98 31.26,26.99
PWM4
  Top 0.203: 25.72,34.66 24.87,34.66 23.5,36.04 23.02,36.04 22.66,36.39 20.84,36.39 20.44,36 20.44,34.96 U2.25 | 25.72,34.66 R32.1 | Q15.1 25.86,34.81 25.72,34.66
PWM4-1
  Top 0.203: R9.1 26.45,42.86 26.45,41.21 24.7,39.46 24.7,37.88 23.97,37.15 Q15.3
  Top 0.254: Q5.1 27.41,43.81 R9.1
PWM4-OUT
  Top 0.762: Q5.3 31.26,40.16 | 31.26,40.16 C5.P | 31.26,40.16 31.42,40.32 D9.C JP5.12V
PWM5
  Top 0.203: U2.27 19.42,34.93 19.42,36.12 21.44,38.15 21.44,39.95 21.87,40.38 R33.1 22.7,41.12 23.34,41.75 Q16.1
  Top 0.254: 19.39,34.91 U2.27
PWM5-1
  Top 0.203: Q6.1 29.53,49.31 | R10.1 29.59,49.21 25.64,45.26 25.64,42.95 25.39,42.7 Q16.3
  Top 0.254: 29.53,49.31 R10.1
PWM5-OUT  (1 unrouted)
  Top 0.762: 33.02,57.29 JP6.12V | Q6.3 33.02,53.18 | 33.02,53.18 C6.P | D10.C 33.02,53.19 33.02,53.18
PWM6  (via drill 0.33)
  Top 0.203: Q17.1 20.63,45.02 19.71,44.11 19.71,41.14 19.41,40.84 19.41,38.99 18.48,38.06 14.48,38.06 14.43,38.11 11.18,38.11 v10.48,37.41 | Q17.1 20.94,46.51 21.11,46.51 | Q17.1 21.59,46.2 22.8,47.41 R34.1 | v11.36,31.29 11.76,30.89 U2.42
  Bottom 0.203: v11.36,31.29 10.48,32.17 v10.48,37.41 | v10.48,37.41
PWM6-1
  Top 0.203: Q7.1 16.2,49.31 | Q17.3 18.36,47.15 R11.1
  Top 0.254: R11.1 16.2,49.31
PWM6-OUT
  Top 0.762: JP7.12V D11.C 19.69,53.18 19.68,53.17 | Q7.3 19.68,53.17 | 19.68,53.17 20.98,53.17 C7.P
PWM7  (via drill 0.33)
  Top 0.203: 17.3,43.92 R35.1 16.31,43.36 16.31,42.21 15.23,41.13 15.23,39.53 | v14.49,38.79 15.23,39.53 | 15.23,39.53 15.38,39.38 Q18.1 | U2.45 12.39,29.39 v12.13,29.65
  Bottom 0.203: v14.49,38.79 13.81,38.11 12.93,38.11 11.98,37.16 11.98,36.11 11.71,35.84 11.71,33.85 12.13,33.43 v12.13,29.65
PWM7-1  (via drill 0.33)
  Top 0.203: Q8.1 2.86,49.31 | v16.03,47.94 16.63,47.35 16.63,46.87 17.89,45.61 17.89,43.29 17.14,42.55 Q18.3 | R12.1 3.87,48.31 9.46,48.31 10.2,49.04 v14.12,49.04 v14.13,49.05
  Top 0.254: 2.86,49.31 R12.1
  Bottom 0.203: v16.03,47.94 14.92,49.05 v14.13,49.05 13.97,49.05
PWM7-OUT
  Top 0.762: JP8.12V D12.C 6.36,53.32 6.51,53.17 | Q8.3 6.51,53.17 | 6.51,53.17 7.65,53.17 C8.P
SCL/TX  (via drill 0.33)
  Top 0.203: JP10.2 5.56,18.42 6.99,19.84 9.93,19.84 10.74,20.66 10.74,20.89 13.87,24.02 v13.92,24.02 | v17.05,28.73 20.2,31.89 U2.21
  Bottom 0.203: v17.05,28.73 17.05,27.81 15.07,25.83 15.07,25.17 v13.92,24.02
SDA/RX  (via drill 0.33)
  Top 0.203: JP10.3 5.56,20.96 6.99,22.38 10.95,22.38 v14.13,25.56 | v16.35,28.1 16.35,29.02 19.72,32.39 U2.22
  Top 0.254: U2.22
  Bottom 0.203: v16.35,28.1 15.86,27.61 15.86,27.3 14.13,25.57
  Bottom 0.254: v14.13,25.56 14.13,25.57
SWCLK  (via drill 0.35)
  Top 0.203: U2.37 13.37,34.41 12.66,35.12 11.15,35.12 v8.91,32.89
  Bottom 0.203: JP9.2 7.94,18.57 6.66,19.86 6.66,32.37 7.17,32.89 v8.91,32.89
SWDIO  (via drill 0.35)
  Top 0.203: U2.34 15.83,34.93 15.83,35.62 15.65,35.79 10.66,35.79 7.58,32.72 v7.58,32.07
  Top 0.254: U2.34 15.85,34.91
  Bottom 0.203: JP9.4 8.1,23.65 7.06,24.69 7.06,31.55 v7.58,32.07
SWO
  Top 0.203: 13.35,32.41 12.49,32.41 11.56,33.34 10.87,33.34 9.21,31.67 9.21,29.05 8.97,28.81 JP9.6
  Top 0.254: U2.39 13.35,32.41
TAC0
  Top 0.203: D5.1 14.46,8.08 | 14.46,8.08 14.92,7.62 R5.1 | 14.46,8.08 14.46,13.56 15.19,14.29 18.57,14.29 20.93,16.64 20.93,22.79 20.45,23.28 20.45,24.96 19.87,25.54 U2.11
TAC0-IN
  Top 0.203: JP1.TAC D5.3
TAC1
  Top 0.203: D6.1 27.46,8.08 | 27.46,8.08 27.79,8.08 28.26,7.62 R6.1 | 27.46,8.08 27.5,8.12 27.47,8.15 27.47,14.58 27.5,14.62 27.5,18.25 21.86,23.89 21.86,26.91 21.87,26.92 U2.13
TAC1-IN
  Top 0.254: D6.3 JP2.TAC
TAC2
  Top 0.203: U2.17 21.92,29.84 22.75,29.84 23.59,29 23.59,26.91 23.08,26.41 23.08,24.39 29.5,17.98 35.71,17.98 37.08,16.61 R7.1 38.85,16.61 40.81,14.65 40.81,9.06 40,8.25 D7.1
TAC2-IN
  Top 0.203: D7.3 JP3.TAC
TAC3
  Top 0.203: D8.1 33.19,31.27 | 33.19,31.27 33.19,31.29 33.97,32.07 R8.1 | U2.19 26.34,30.89 26.76,31.31 28.88,31.31 28.9,31.29 33.17,31.29 33.19,31.27
TAC3-IN
  Top 0.203: D8.3 JP4.TAC
TAC4
  Top 0.203: D13.1 33.19,44.94 | 33.19,44.94 33.66,45.4 R13.1 | 19.92,34.93 U2.26 19.87,36 21.85,37.98 21.85,39.3 22.07,39.53 24.19,39.53 26.04,41.38 26.04,41.43 26.04,43.93 27.05,44.94 33.19,44.94
TAC4-IN
  Top 0.254: D13.3 JP5.TAC
TAC5
  Top 0.203: D14.1 28.57,55.1 28.54,55.06 | 28.54,55.06 27.94,55.66 R14.1 | U2.28 18.92,34.93 18.92,36.2 21.03,38.31 21.03,40.17 21.34,40.47 21.34,43.44 22.68,44.78 24.58,44.78 28.54,48.73 28.54,55.06
  Top 0.254: 18.89,34.91 U2.28
TAC5-IN
  Top 0.203: D14.3 JP6.TAC
TAC6  (via drill 0.33)
  Top 0.203: 15.4,55.1 15.39,55.1 14.61,55.88 R15.1 | 15.4,55.1 D15.1 | 15.4,55.1 15.36,55.06 15.36,47.66 15.9,47.12 15.9,42.38 14.82,41.3 14.82,40.07 13.27,38.52 10.63,38.52 9.8,37.69 9.8,37.68 v9.54,37.41 | 13.35,30.41 11.52,30.41 v11.38,30.27
  Top 0.254: U2.43 13.35,30.41
  Bottom 0.203: 9.53,37.4 v9.54,37.41 9.8,37.15 9.8,37.14 10.07,36.87 10.07,31.59 v11.38,30.27
TAC6-IN
  Top 0.203: D15.3 JP7.TAC
TAC7  (via drill 0.33)
  Top 0.203: D16.1 2.86,52.64 2.03,51.81 2.03,48.63 2.78,47.88 10.33,47.88 | U2.46 v11.27,28.89 | R16.1 10.64,47.78 11.49,48.64 13.06,48.64 15.09,46.61 15.09,42.72 14.01,41.64 14.01,40.41 12.93,39.33 9.42,39.33 8.73,38.64 v8.73,36.83
  Top 0.254: 10.33,47.88 R16.1 10.6,47.78 | 13.35,28.91 U2.46
  Bottom 0.203: v11.27,28.89 10.48,29.68 10.48,30.6 9.66,31.42 9.66,35.9 v8.73,36.83
TAC7-IN
  Top 0.203: D16.3 JP8.TAC
USB_N
  Top 0.203: CN1.DM 5.88,28.27 6.44,28.83 6.44,33.43 9.75,36.74 16.03,36.74 16.87,35.9 U2.32
USB_P
  Top 0.203: CN1.DP 5.88,27.62 6.9,28.64 6.9,30.96 | 6.9,30.96 6.9,33.24 9.94,36.28 15.88,36.28 16.37,35.79 U2.33 | R27.1 6.9,30.96
USB_PU
  Top 0.203: R27.2 11.06,31.96 11.64,31.96 12.21,31.39 U2.41
VBUS
  Top 0.254: D17.1 Q10.1 1.04,45 1.04,34.99 3.33,32.7 3.33,31.75 4.34,30.74 R26.2 5.4,29.21 5.11,28.92 CN1.VBUS
VIN
  Top 0.254: Q10.3 D17.3 | D17.3 9.19,46.04 U1.1 | D17.3 9.19,44.13 U1.3 9.92,43 C9.1

### Text on the board
tNames: +5V | +12V | SDA / RX | SCL / TX | GND
bNames: CH7 | CH6 | CH5 | Fan Controller / V1.3 / By Tuetuopay | CH4 | CH3 | SWO | NRST | SWDIO | SWCLK | +3V3 | CH0 | CH1 | CH2